# Altium schematic sheet uP.SchDoc
size A3
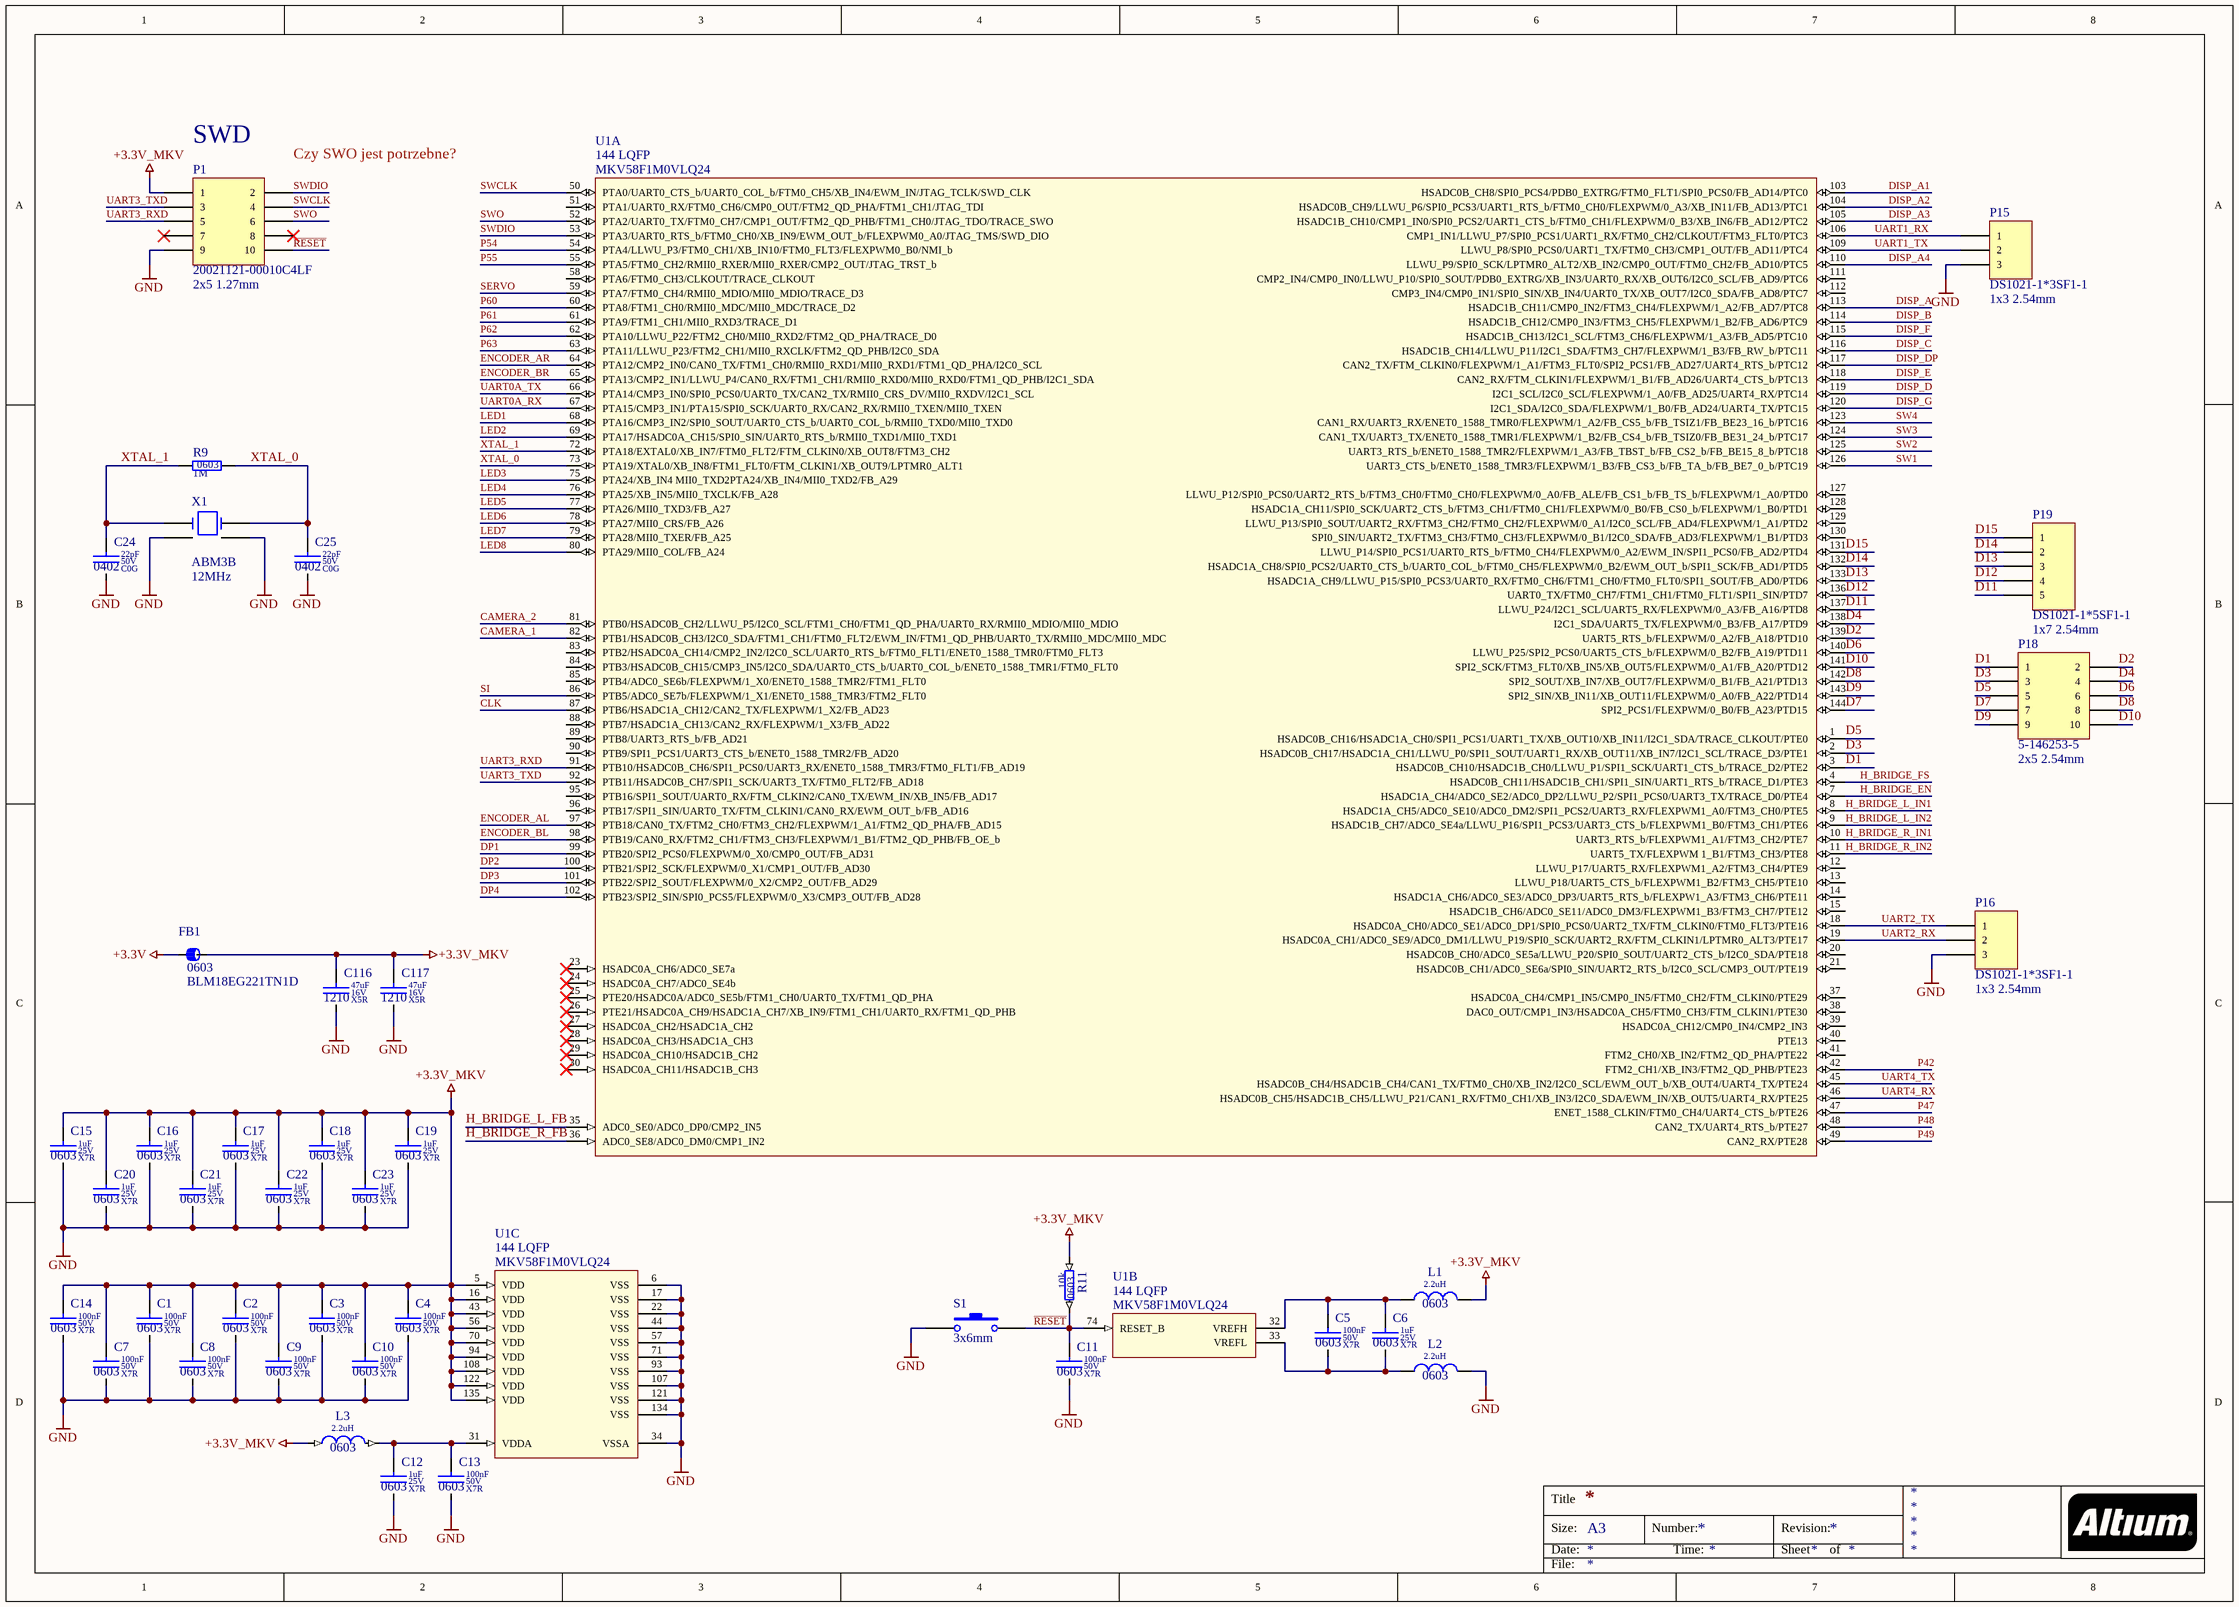
[diagram p0: uP.SchDoc]

## Parts
C1  value 100nF  Dielectric: X7R  Voltage: 50V  SCH_Footprint: 0603  [C_0603_1608]  (hidden comment: Ceramic X7R)
C2  value 100nF  Dielectric: X7R  Voltage: 50V  SCH_Footprint: 0603  [C_0603_1608]  (hidden comment: Ceramic X7R)
C3  value 100nF  Dielectric: X7R  Voltage: 50V  SCH_Footprint: 0603  [C_0603_1608]  (hidden comment: Ceramic X7R)
C4  value 100nF  Dielectric: X7R  Voltage: 50V  SCH_Footprint: 0603  [C_0603_1608]  (hidden comment: Ceramic X7R)
C5  value 100nF  Dielectric: X7R  Voltage: 50V  SCH_Footprint: 0603  [C_0603_1608]  (hidden comment: Ceramic X7R)
C6  value 1uF  Dielectric: X7R  Voltage: 25V  SCH_Footprint: 0603  [C_0603_1608]  (hidden comment: Ceramic X7R)
C7  value 100nF  Dielectric: X7R  Voltage: 50V  SCH_Footprint: 0603  [C_0603_1608]  (hidden comment: Ceramic X7R)
C8  value 100nF  Dielectric: X7R  Voltage: 50V  SCH_Footprint: 0603  [C_0603_1608]  (hidden comment: Ceramic X7R)
C9  value 100nF  Dielectric: X7R  Voltage: 50V  SCH_Footprint: 0603  [C_0603_1608]  (hidden comment: Ceramic X7R)
C10  value 100nF  Dielectric: X7R  Voltage: 50V  SCH_Footprint: 0603  [C_0603_1608]  (hidden comment: Ceramic X7R)
C11  value 100nF  Dielectric: X7R  Voltage: 50V  SCH_Footprint: 0603  [C_0603_1608]  (hidden comment: Ceramic X7R)
C12  value 1uF  Dielectric: X7R  Voltage: 25V  SCH_Footprint: 0603  [C_0603_1608]  (hidden comment: Ceramic X7R)
C13  value 100nF  Dielectric: X7R  Voltage: 50V  SCH_Footprint: 0603  [C_0603_1608]  (hidden comment: Ceramic X7R)
C14  value 100nF  Dielectric: X7R  Voltage: 50V  SCH_Footprint: 0603  [C_0603_1608]  (hidden comment: Ceramic X7R)
C15  value 1uF  Dielectric: X7R  Voltage: 25V  SCH_Footprint: 0603  [C_0603_1608]  (hidden comment: Ceramic X7R)
C16  value 1uF  Dielectric: X7R  Voltage: 25V  SCH_Footprint: 0603  [C_0603_1608]  (hidden comment: Ceramic X7R)
C17  value 1uF  Dielectric: X7R  Voltage: 25V  SCH_Footprint: 0603  [C_0603_1608]  (hidden comment: Ceramic X7R)
C18  value 1uF  Dielectric: X7R  Voltage: 25V  SCH_Footprint: 0603  [C_0603_1608]  (hidden comment: Ceramic X7R)
C19  value 1uF  Dielectric: X7R  Voltage: 25V  SCH_Footprint: 0603  [C_0603_1608]  (hidden comment: Ceramic X7R)
C20  value 1uF  Dielectric: X7R  Voltage: 25V  SCH_Footprint: 0603  [C_0603_1608]  (hidden comment: Ceramic X7R)
C21  value 1uF  Dielectric: X7R  Voltage: 25V  SCH_Footprint: 0603  [C_0603_1608]  (hidden comment: Ceramic X7R)
C22  value 1uF  Dielectric: X7R  Voltage: 25V  SCH_Footprint: 0603  [C_0603_1608]  (hidden comment: Ceramic X7R)
C23  value 1uF  Dielectric: X7R  Voltage: 25V  SCH_Footprint: 0603  [C_0603_1608]  (hidden comment: Ceramic X7R)
C24  value 22pF  Dielectric: C0G  Voltage: 50V  SCH_Footprint: 0402  [C_0402_1005]  (hidden comment: Ceramic C0G)
C25  value 22pF  Dielectric: C0G  Voltage: 50V  SCH_Footprint: 0402  [C_0402_1005]  (hidden comment: Ceramic C0G)
C116  value 47uF  Dielectric: X5R  Voltage: 16V  SCH_Footprint: 1210  [C_1210_3225]  (hidden comment: Ceramic X5R)
C117  value 47uF  Dielectric: X5R  Voltage: 16V  SCH_Footprint: 1210  [C_1210_3225]  (hidden comment: Ceramic X5R)
FB1  value BLM18EG221TN1D  SCH_Footprint: 0603  [FB_0603_1608]  (hidden comment: Ferrite bead)
L1  value 2.2uH  SCH_Footprint: 0603  [L_0603_1608]  (hidden comment: Inductor)
L2  value 2.2uH  SCH_Footprint: 0603  [L_0603_1608]  (hidden comment: Inductor)
L3  value 2.2uH  SCH_Footprint: 0603  [L_0603_1608]  (hidden comment: Inductor)
P1  value 20021121-00010C4LF  SCH_Footprint: 2x5 1.27mm  [P_HEADER_2x5_1.27]  (hidden comment: Jtag)
P15  value DS1021-1*3SF1-1  SCH_Footprint: 1x3 2.54mm  [P_HEADER_1x3_2.54]  (hidden comment: Goldpin)
P16  value DS1021-1*3SF1-1  SCH_Footprint: 1x3 2.54mm  [P_HEADER_1x3_2.54]  (hidden comment: Goldpin)
P18  value 5-146253-5  SCH_Footprint: 2x5 2.54mm  [P_HEADER_2x5_2.54]  (hidden comment: Goldpin)
P19  value DS1021-1*5SF1-1  SCH_Footprint: 1x7 2.54mm  [P_HEADER_1x5_2.54]  (hidden comment: Goldpin)
R9  value 1M  SCH_Footprint: 0603  [R_0603_1608]  (hidden comment: Resistor)
R11  value 10k  SCH_Footprint: 0603  [R_0603_1608]  (hidden comment: Resistor)
S1  3x6mm  [S_TACTSWITCH3x6]
U1  SCH_Footprint: 144 LQFP  [LQFP144_20x20]  (hidden comment: MKV58F1M0VLQ24)  (parts A,B,C of 3)
X1  value 12MHz  SCH_Footprint: ABM3B  [X_ABM3B_5X3X11]  (hidden comment: X_ABM3B)

## Nets
+3.3V: FB1.1
+3.3V_MKV: C1.1 C2.1 C3.1 C4.1 C7.1 C8.1 C9.1 C10.1 C14.1 C15.1 C16.1 C17.1 C18.1 C19.1 C20.1 C21.1 C22.1 C23.1 C116.1 C117.1 FB1.2 L1.2 L3.1 P1.1 R11.1 U1.5(VDD) U1.16(VDD) U1.43(VDD) U1.56(VDD) U1.70(VDD) U1.94(VDD) U1.108(VDD) U1.122(VDD) U1.135(VDD)
GND: C1.2 C2.2 C3.2 C4.2 C7.2 C8.2 C9.2 C10.2 C11.2 C12.2 C13.2 C14.2 C15.2 C16.2 C17.2 C18.2 C19.2 C20.2 C21.2 C22.2 C23.2 C24.2 C25.2 C116.2 C117.2 L2.2 P1.9 P15.3 P16.3 S1.1 U1.6(VSS) U1.17(VSS) U1.22(VSS) U1.34(VSSA) U1.44(VSS) U1.57(VSS) U1.71(VSS) U1.93(VSS) U1.107(VSS) U1.121(VSS) U1.134(VSS) X1.2(GND) X1.4(GND)
CAMERA_1: U1.82(PTB1/HSADC0B_CH3/I2C0_SDA/FTM1_CH1/FTM0_FLT2/EWM_IN/FTM1_QD_PHB/UART0_TX/RMII0_MDC/MII0_MDC)
CAMERA_2: U1.81(PTB0/HSADC0B_CH2/LLWU_P5/I2C0_SCL/FTM1_CH0/FTM1_QD_PHA/UART0_RX/RMII0_MDIO/MII0_MDIO)
CLK: U1.87(PTB6/HSADC1A_CH12/CAN2_TX/FLEXPWM/1_X2/FB_AD23)
D1: P18.1 U1.3(HSADC0B_CH10/HSADC1B_CH0/LLWU_P1/SPI1_SCK/UART1_CTS_b/TRACE_D2/PTE2)
D2: P18.2 U1.139(UART5_RTS_b/FLEXPWM/0_A2/FB_A18/PTD10)
D3: P18.3 U1.2(HSADC0B_CH17/HSADC1A_CH1/LLWU_P0/SPI1_SOUT/UART1_RX/XB_OUT11/XB_IN7/I2C1_SCL/TRACE_D3/PTE1)
D4: P18.4 U1.138(I2C1_SDA/UART5_TX/FLEXPWM/0_B3/FB_A17/PTD9)
D5: P18.5 U1.1(HSADC0B_CH16/HSADC1A_CH0/SPI1_PCS1/UART1_TX/XB_OUT10/XB_IN11/I2C1_SDA/TRACE_CLKOUT/PTE0)
D6: P18.6 U1.140(LLWU_P25/SPI2_PCS0/UART5_CTS_b/FLEXPWM/0_B2/FB_A19/PTD11)
D7: P18.7 U1.144(SPI2_PCS1/FLEXPWM/0_B0/FB_A23/PTD15)
D8: P18.8 U1.142(SPI2_SOUT/XB_IN7/XB_OUT7/FLEXPWM/0_B1/FB_A21/PTD13)
D9: P18.9 U1.143(SPI2_SIN/XB_IN11/XB_OUT11/FLEXPWM/0_A0/FB_A22/PTD14)
D10: P18.10 U1.141(SPI2_SCK/FTM3_FLT0/XB_IN5/XB_OUT5/FLEXPWM/0_A1/FB_A20/PTD12)
D11: P19.5 U1.137(LLWU_P24/I2C1_SCL/UART5_RX/FLEXPWM/0_A3/FB_A16/PTD8)
D12: P19.4 U1.136(UART0_TX/FTM0_CH7/FTM1_CH1/FTM0_FLT1/SPI1_SIN/PTD7)
D13: P19.3 U1.133(HSADC1A_CH9/LLWU_P15/SPI0_PCS3/UART0_RX/FTM0_CH6/FTM1_CH0/FTM0_FLT0/SPI1_SOUT/FB_AD0/PTD6)
D14: P19.2 U1.132(HSADC1A_CH8/SPI0_PCS2/UART0_CTS_b/UART0_COL_b/FTM0_CH5/FLEXPWM/0_B2/EWM_OUT_b/SPI1_SCK/FB_AD1/PTD5)
D15: P19.1 U1.131(LLWU_P14/SPI0_PCS1/UART0_RTS_b/FTM0_CH4/FLEXPWM/0_A2/EWM_IN/SPI1_PCS0/FB_AD2/PTD4)
DISP_A: U1.113(HSADC1B_CH11/CMP0_IN2/FTM3_CH4/FLEXPWM/1_A2/FB_AD7/PTC8)
DISP_A1: U1.103(HSADC0B_CH8/SPI0_PCS4/PDB0_EXTRG/FTM0_FLT1/SPI0_PCS0/FB_AD14/PTC0)
DISP_A2: U1.104(HSADC0B_CH9/LLWU_P6/SPI0_PCS3/UART1_RTS_b/FTM0_CH0/FLEXPWM/0_A3/XB_IN11/FB_AD13/PTC1)
DISP_A3: U1.105(HSADC1B_CH10/CMP1_IN0/SPI0_PCS2/UART1_CTS_b/FTM0_CH1/FLEXPWM/0_B3/XB_IN6/FB_AD12/PTC2)
DISP_A4: U1.110(LLWU_P9/SPI0_SCK/LPTMR0_ALT2/XB_IN2/CMP0_OUT/FTM0_CH2/FB_AD10/PTC5)
DISP_B: U1.114(HSADC1B_CH12/CMP0_IN3/FTM3_CH5/FLEXPWM/1_B2/FB_AD6/PTC9)
DISP_C: U1.116(HSADC1B_CH14/LLWU_P11/I2C1_SDA/FTM3_CH7/FLEXPWM/1_B3/FB_RW_b/PTC11)
DISP_D: U1.119(I2C1_SCL/I2C0_SCL/FLEXPWM/1_A0/FB_AD25/UART4_RX/PTC14)
DISP_DP: U1.117(CAN2_TX/FTM_CLKIN0/FLEXPWM/1_A1/FTM3_FLT0/SPI2_PCS1/FB_AD27/UART4_RTS_b/PTC12)
DISP_E: U1.118(CAN2_RX/FTM_CLKIN1/FLEXPWM/1_B1/FB_AD26/UART4_CTS_b/PTC13)
DISP_F: U1.115(HSADC1B_CH13/I2C1_SCL/FTM3_CH6/FLEXPWM/1_A3/FB_AD5/PTC10)
DISP_G: U1.120(I2C1_SDA/I2C0_SDA/FLEXPWM/1_B0/FB_AD24/UART4_TX/PTC15)
DP1: U1.99(PTB20/SPI2_PCS0/FLEXPWM/0_X0/CMP0_OUT/FB_AD31)
DP2: U1.100(PTB21/SPI2_SCK/FLEXPWM/0_X1/CMP1_OUT/FB_AD30)
DP3: U1.101(PTB22/SPI2_SOUT/FLEXPWM/0_X2/CMP2_OUT/FB_AD29)
DP4: U1.102(PTB23/SPI2_SIN/SPI0_PCS5/FLEXPWM/0_X3/CMP3_OUT/FB_AD28)
ENCODER_AL: U1.97(PTB18/CAN0_TX/FTM2_CH0/FTM3_CH2/FLEXPWM/1_A1/FTM2_QD_PHA/FB_AD15)
ENCODER_AR: U1.64(PTA12/CMP2_IN0/CAN0_TX/FTM1_CH0/RMII0_RXD1/MII0_RXD1/FTM1_QD_PHA/I2C0_SCL)
ENCODER_BL: U1.98(PTB19/CAN0_RX/FTM2_CH1/FTM3_CH3/FLEXPWM/1_B1/FTM2_QD_PHB/FB_OE_b)
ENCODER_BR: U1.65(PTA13/CMP2_IN1/LLWU_P4/CAN0_RX/FTM1_CH1/RMII0_RXD0/MII0_RXD0/FTM1_QD_PHB/I2C1_SDA)
H_BRIDGE_EN: U1.7(HSADC1A_CH4/ADC0_SE2/ADC0_DP2/LLWU_P2/SPI1_PCS0/UART3_TX/TRACE_D0/PTE4)
H_BRIDGE_FS: U1.4(HSADC0B_CH11/HSADC1B_CH1/SPI1_SIN/UART1_RTS_b/TRACE_D1/PTE3)
H_BRIDGE_L_FB: U1.35(ADC0_SE0/ADC0_DP0/CMP2_IN5)
H_BRIDGE_L_IN1: U1.8(HSADC1A_CH5/ADC0_SE10/ADC0_DM2/SPI1_PCS2/UART3_RX/FLEXPWM1_A0/FTM3_CH0/PTE5)
H_BRIDGE_L_IN2: U1.9(HSADC1B_CH7/ADC0_SE4a/LLWU_P16/SPI1_PCS3/UART3_CTS_b/FLEXPWM1_B0/FTM3_CH1/PTE6)
H_BRIDGE_R_FB: U1.36(ADC0_SE8/ADC0_DM0/CMP1_IN2)
H_BRIDGE_R_IN1: U1.10(UART3_RTS_b/FLEXPWM1_A1/FTM3_CH2/PTE7)
H_BRIDGE_R_IN2: U1.11(UART5_TX/FLEXPWM_1_B1/FTM3_CH3/PTE8)
LED1: U1.68(PTA16/CMP3_IN2/SPI0_SOUT/UART0_CTS_b/UART0_COL_b/RMII0_TXD0/MII0_TXD0)
LED2: U1.69(PTA17/HSADC0A_CH15/SPI0_SIN/UART0_RTS_b/RMII0_TXD1/MII0_TXD1)
LED3: U1.75(PTA24/XB_IN4_MII0_TXD2PTA24/XB_IN4/MII0_TXD2/FB_A29)
LED4: U1.76(PTA25/XB_IN5/MII0_TXCLK/FB_A28)
LED5: U1.77(PTA26/MII0_TXD3/FB_A27)
LED6: U1.78(PTA27/MII0_CRS/FB_A26)
LED7: U1.79(PTA28/MII0_TXER/FB_A25)
LED8: U1.80(PTA29/MII0_COL/FB_A24)
P42: U1.42(FTM2_CH1/XB_IN3/FTM2_QD_PHB/PTE23)
P47: U1.47(ENET_1588_CLKIN/FTM0_CH4/UART4_CTS_b/PTE26)
P48: U1.48(CAN2_TX/UART4_RTS_b/PTE27)
P49: U1.49(CAN2_RX/PTE28)
P54: U1.54(PTA4/LLWU_P3/FTM0_CH1/XB_IN10/FTM0_FLT3/FLEXPWM0_B0/NMI_b)
P55: U1.55(PTA5/FTM0_CH2/RMII0_RXER/MII0_RXER/CMP2_OUT/JTAG_TRST_b)
P60: U1.60(PTA8/FTM1_CH0/RMII0_MDC/MII0_MDC/TRACE_D2)
P61: U1.61(PTA9/FTM1_CH1/MII0_RXD3/TRACE_D1)
P62: U1.62(PTA10/LLWU_P22/FTM2_CH0/MII0_RXD2/FTM2_QD_PHA/TRACE_D0)
P63: U1.63(PTA11/LLWU_P23/FTM2_CH1/MII0_RXCLK/FTM2_QD_PHB/I2C0_SDA)
~{RESET}: C11.1 P1.10 R11.2 S1.2 U1.74(RESET_B)
SERVO: U1.59(PTA7/FTM0_CH4/RMII0_MDIO/MII0_MDIO/TRACE_D3)
SI: U1.86(PTB5/ADC0_SE7b/FLEXPWM/1_X1/ENET0_1588_TMR3/FTM2_FLT0)
SW1: U1.126(UART3_CTS_b/ENET0_1588_TMR3/FLEXPWM/1_B3/FB_CS3_b/FB_TA_b/FB_BE7_0_b/PTC19)
SW2: U1.125(UART3_RTS_b/ENET0_1588_TMR2/FLEXPWM/1_A3/FB_TBST_b/FB_CS2_b/FB_BE15_8_b/PTC18)
SW3: U1.124(CAN1_TX/UART3_TX/ENET0_1588_TMR1/FLEXPWM/1_B2/FB_CS4_b/FB_TSIZ0/FB_BE31_24_b/PTC17)
SW4: U1.123(CAN1_RX/UART3_RX/ENET0_1588_TMR0/FLEXPWM/1_A2/FB_CS5_b/FB_TSIZ1/FB_BE23_16_b/PTC16)
SWCLK: P1.4 U1.50(PTA0/UART0_CTS_b/UART0_COL_b/FTM0_CH5/XB_IN4/EWM_IN/JTAG_TCLK/SWD_CLK)
SWDIO: P1.2 U1.53(PTA3/UART0_RTS_b/FTM0_CH0/XB_IN9/EWM_OUT_b/FLEXPWM0_A0/JTAG_TMS/SWD_DIO)
SWO: P1.6 U1.52(PTA2/UART0_TX/FTM0_CH7/CMP1_OUT/FTM2_QD_PHB/FTM1_CH0/JTAG_TDO/TRACE_SWO)
UART0A_RX: U1.67(PTA15/CMP3_IN1/PTA15/SPI0_SCK/UART0_RX/CAN2_RX/RMII0_TXEN/MII0_TXEN)
UART0A_TX: U1.66(PTA14/CMP3_IN0/SPI0_PCS0/UART0_TX/CAN2_TX/RMII0_CRS_DV/MII0_RXDV/I2C1_SCL)
UART1_RX: P15.1 U1.106(CMP1_IN1/LLWU_P7/SPI0_PCS1/UART1_RX/FTM0_CH2/CLKOUT/FTM3_FLT0/PTC3)
UART1_TX: P15.2 U1.109(LLWU_P8/SPI0_PCS0/UART1_TX/FTM0_CH3/CMP1_OUT/FB_AD11/PTC4)
UART2_RX: P16.2 U1.19(HSADC0A_CH1/ADC0_SE9/ADC0_DM1/LLWU_P19/SPI0_SCK/UART2_RX/FTM_CLKIN1/LPTMR0_ALT3/PTE17)
UART2_TX: P16.1 U1.18(HSADC0A_CH0/ADC0_SE1/ADC0_DP1/SPI0_PCS0/UART2_TX/FTM_CLKIN0/FTM0_FLT3/PTE16)
UART3_RXD: P1.5 U1.91(PTB10/HSADC0B_CH6/SPI1_PCS0/UART3_RX/ENET0_1588_TMR3/FTM0_FLT1/FB_AD19)
UART3_TXD: P1.3 U1.92(PTB11/HSADC0B_CH7/SPI1_SCK/UART3_TX/FTM0_FLT2/FB_AD18)
UART4_RX: U1.46(HSADC0B_CH5/HSADC1B_CH5/LLWU_P21/CAN1_RX/FTM0_CH1/XB_IN3/I2C0_SDA/EWM_IN/XB_OUT5/UART4_RX/PTE25)
UART4_TX: U1.45(HSADC0B_CH4/HSADC1B_CH4/CAN1_TX/FTM0_CH0/XB_IN2/I2C0_SCL/EWM_OUT_b/XB_OUT4/UART4_TX/PTE24)
XTAL_0: C25.1 R9.2 U1.73(PTA19/XTAL0/XB_IN8/FTM1_FLT0/FTM_CLKIN1/XB_OUT9/LPTMR0_ALT1) X1.1
XTAL_1: C24.1 R9.1 U1.72(PTA18/EXTAL0/XB_IN7/FTM0_FLT2/FTM_CLKIN0/XB_OUT8/FTM3_CH2) X1.3
NetC5_1: C5.1 C6.1 L1.1 U1.32(VREFH)
NetC5_2: C5.2 C6.2 L2.1 U1.33(VREFL)
NetC12_1: C12.1 C13.1 L3.2 U1.31(VDDA)

Not connected (* = marked no-connect by the designer): P1 7* 8*; U1 12(LLWU_P17/UART5_RX/FLEXPWM1_A2/FTM3_CH4/PTE9) 13(LLWU_P18/UART5_CTS_b/FLEXPWM1_B2/FTM3_CH5/PTE10) 14(HSADC1A_CH6/ADC0_SE3/ADC0_DP3/UART5_RTS_b/FLEXPW1_A3/FTM3_CH6/PTE11) 15(HSADC1B_CH6/ADC0_SE11/ADC0_DM3/FLEXPWM1_B3/FTM3_CH7/PTE12) 20(HSADC0B_CH0/ADC0_SE5a/LLWU_P20/SPI0_SOUT/UART2_CTS_b/I2C0_SDA/PTE18) 21(HSADC0B_CH1/ADC0_SE6a/SPI0_SIN/UART2_RTS_b/I2C0_SCL/CMP3_OUT/PTE19) 23(HSADC0A_CH6/ADC0_SE7a)* 24(HSADC0A_CH7/ADC0_SE4b)* 25(PTE20/HSADC0A/ADC0_SE5b/FTM1_CH0/UART0_TX/FTM1_QD_PHA)* 26(PTE21/HSADC0A_CH9/HSADC1A_CH7/XB_IN9/FTM1_CH1/UART0_RX/FTM1_QD_PHB)* 27(HSADC0A_CH2/HSADC1A_CH2)* 28(HSADC0A_CH3/HSADC1A_CH3)* 29(HSADC0A_CH10/HSADC1B_CH2)* 30(HSADC0A_CH11/HSADC1B_CH3)* 37(HSADC0A_CH4/CMP1_IN5/CMP0_IN5/FTM0_CH2/FTM_CLKIN0/PTE29) 38(DAC0_OUT/CMP1_IN3/HSADC0A_CH5/FTM0_CH3/FTM_CLKIN1/PTE30) 39(HSADC0A_CH12/CMP0_IN4/CMP2_IN3) 40(PTE13) 41(FTM2_CH0/XB_IN2/FTM2_QD_PHA/PTE22) 51(PTA1/UART0_RX/FTM0_CH6/CMP0_OUT/FTM2_QD_PHA/FTM1_CH1/JTAG_TDI) 58(PTA6/FTM0_CH3/CLKOUT/TRACE_CLKOUT) 83(PTB2/HSADC0A_CH14/CMP2_IN2/I2C0_SCL/UART0_RTS_b/FTM0_FLT1/ENET0_1588_TMR0/FTM0_FLT3) 84(PTB3/HSADC0B_CH15/CMP3_IN5/I2C0_SDA/UART0_CTS_b/UART0_COL_b/ENET0_1588_TMR1/FTM0_FLT0) 85(PTB4/ADC0_SE6b/FLEXPWM/1_X0/ENET0_1588_TMR2/FTM1_FLT0) 88(PTB7/HSADC1A_CH13/CAN2_RX/FLEXPWM/1_X3/FB_AD22) 89(PTB8/UART3_RTS_b/FB_AD21) 90(PTB9/SPI1_PCS1/UART3_CTS_b/ENET0_1588_TMR2/FB_AD20) 95(PTB16/SPI1_SOUT/UART0_RX/FTM_CLKIN2/CAN0_TX/EWM_IN/XB_IN5/FB_AD17) 96(PTB17/SPI1_SIN/UART0_TX/FTM_CLKIN1/CAN0_RX/EWM_OUT_b/FB_AD16) 111(CMP2_IN4/CMP0_IN0/LLWU_P10/SPI0_SOUT/PDB0_EXTRG/XB_IN3/UART0_RX/XB_OUT6/I2C0_SCL/FB_AD9/PTC6) 112(CMP3_IN4/CMP0_IN1/SPI0_SIN/XB_IN4/UART0_TX/XB_OUT7/I2C0_SDA/FB_AD8/PTC7) 127(LLWU_P12/SPI0_PCS0/UART2_RTS_b/FTM3_CH0/FTM0_CH0/FLEXPWM/0_A0/FB_ALE/FB_CS1_b/FB_TS_b/FLEXPWM/1_A0/PTD0) 128(HSADC1A_CH11/SPI0_SCK/UART2_CTS_b/FTM3_CH1/FTM0_CH1/FLEXPWM/0_B0/FB_CS0_b/FLEXPWM/1_B0/PTD1) 129(LLWU_P13/SPI0_SOUT/UART2_RX/FTM3_CH2/FTM0_CH2/FLEXPWM/0_A1/I2C0_SCL/FB_AD4/FLEXPWM/1_A1/PTD2) 130(SPI0_SIN/UART2_TX/FTM3_CH3/FTM0_CH3/FLEXPWM/0_B1/I2C0_SDA/FB_AD3/FLEXPWM/1_B1/PTD3)

## Notes on the sheet
- (near P1) SWD
- (near P1) Czy SWO jest potrzebne?
- Title
- Size:
- Date:
- A3
- Number:
- Time:
- Revision:
- Sheet
- of
- File:

## Library data of the parts
C1-C5 C7-C11 C13 C14 = C_100nF_50V_X7R_0603_5: Capacitor; Manufacturer: Samsung; Manufacturer Part Number: CL10B104JB8NNNC; Tolerance (%): 5; Part Number: C_100nF_50V_X7R_0603_5; HelpURL: http://www.tme.eu/pl/Document/4a42202b32dab16128fe107dd69598cc/samsung-chip-cap.pdf; Supplier 1: TME; Supplier Part Number 1: CL10B104JB8NNNC; Supplier 2: RS Components; Supplier 3: Farnell; Supplier 4: Mouser; Supplier 5: Digi-Key
C6 C12 C15-C23 = C_1uF_25V_X7R_0603_10: Capacitor; Manufacturer: Samsung; Manufacturer Part Number: CL10B105KA8NNNC; Tolerance (%): 10; Part Number: C_1uF_25V_X7R_0603_10; HelpURL: http://www.tme.eu/pl/Document/4a42202b32dab16128fe107dd69598cc/samsung-chip-cap.pdf; Supplier 1: TME; Supplier Part Number 1: CL10B105KA8NNNC; Supplier 2: RS Components; Supplier 3: Farnell; Supplier 4: Mouser; Supplier 5: Digi-Key
C24 C25 = C_22pF_50V_C0G_0402_5: Capacitor; Manufacturer: AVX; Manufacturer Part Number: 04025A220JAT2A; Tolerance (%): 5; Part Number: C_22pF_50V_C0G_0402_5; HelpURL: http://datasheet.octopart.com/04025A220JAT2A-AVX-datasheet-9883399.pdf; Supplier 1: TME; Supplier Part Number 1: 04025A220JAT2A; Supplier 2: RS Components; Supplier Part Number 2: 6983087; Supplier 3: Farnell; Supplier Part Number 3: 2280776; Supplier 4: Mouser; Supplier Part Number 4: 581-04025A220J; Supplier 5: Digi-Key; Supplier Part Number 5: 478-1074-1-ND
C116 C117 = C_47uF_16V_X5R_1210_10: Capacitor; Manufacturer: Samsung; Manufacturer Part Number: CL32A476KOJNNNE; Tolerance (%): 10; Part Number: C_47uF_16V_X5R_1210_10; HelpURL: http://www.samsungsem.com/kr/support/product-search/mlcc/__icsFiles/afieldfile/2018/06/21/CL32A476KOJNNNE.pdf; Supplier 1: TME; Supplier 2: RS Components; Supplier 3: Farnell; Supplier 4: Mouser; Supplier 5: Digi-Key; Supplier Part Number 5: 1276-3376-1-ND
FB1 = FB_BLM18EG221TN1D: Manufacturer: Murata; Current: 1A; Resistance: 150mR; Part Number: FB_BLM18EG221TN1D; HelpURL: http://datasheet.octopart.com/BLM18EG221TN1D-Murata-datasheet-66919.pdf; Manufacturer Part Number: BLM18EG221TN1D; Supplier 1: TME; Supplier 2: RS Components; Supplier Part Number 2: 7926243P; Supplier 3: Farnell; Supplier Part Number 3: 1515717; Supplier 4: Mouser; Supplier Part Number 4: 81-BLM18EG221TN1D; Supplier 5: Digi-Key; Supplier Part Number 5: 490-5979-1-ND
L1-L3 = L_2.2uH_130mA_0603: Induction; Manufacturer: TDK; Manufacturer Part Number: MLZ1608A2R2WT000; Current: 130mA; Resistance: 250mR; Part Number: L_2.2uH_130mA_0603; HelpURL: http://datasheet.octopart.com/MLZ1608A2R2WT000-TDK-datasheet-38159369.pdf; Supplier 1: TME; Supplier 2: RS Components; Supplier 3: Farnell; Supplier Part Number 3: 2215629; Supplier 4: Mouser; Supplier Part Number 4: 810-MLZ1608A2R2WT000; Supplier 5: Digi-Key; Supplier Part Number 5: 445-6385-1-ND
P1 = P_HEADER_2x5_1.27: Header, 10-Pin, Dual row; Manufacturer: FCI; Part Number: P_HEADER_2x5_1.27; Component Type: Standard; HelpURL: http://www.mouser.com/catalog/645/usd/1591.pdf; Manufacturer Part Number: 20021121-00010C4LF; Supplier 1: TME; Supplier 2: RS Components; Supplier 3: Farnell; Supplier 4: Mouser; Supplier 5: Digi-Key
P15 P16 = P_HEADER_1x3_2.54: Header, 3-Pin; Manufacturer: Connfly; Part Number: P_HEADER_1x3_2.54; Component Type: Standard; HelpURL: http://www.tme.eu/en/Document/cc301e58a5da78cb543a94b5a5b7f06a/DS1021.pdf; Manufacturer Part Number: DS1021-1*3SF1-1; Supplier 1: TME; Supplier Part Number 1: ZL201-03G; Supplier 2: RS Components; Supplier 3: Farnell; Supplier 4: Mouser; Supplier 5: Digi-Key
P18 = P_HEADER_2x5_2.54: Header, 10-Pin, Dual row; Manufacturer: TE Connectivity; Part Number: P_HEADER_2x5_2.54; Component Type: Standard; HelpURL: https://sigma.octopart.com/11631052/technical_drawing/TE-Connectivity-5-146253-5.pdf; Manufacturer Part Number: 5-146253-5; Supplier 1: TME; Supplier 2: RS Components; Supplier Part Number 2: 782-9205; Supplier 3: Farnell; Supplier Part Number 3: 2311131; Supplier 4: Mouser; Supplier Part Number 4: 571-5-146253-5; Supplier 5: Digi-Key; Supplier Part Number 5: A121461-ND
P19 = P_HEADER_1x5_2.54: Header, 5-Pin; Manufacturer: Connfly; Part Number: P_HEADER_1x5_2.54; Component Type: Standard; HelpURL: http://datasheet.octopart.com/DS1021-1%2A5SF1-1-Connfly-datasheet-65537859.pdf; Manufacturer Part Number: DS1021-1*5SF1-1; Supplier 1: TME; Supplier Part Number 1: ZL201-05G; Supplier 2: RS Components; Supplier 3: Farnell; Supplier 4: Mouser; Supplier 5: Digi-Key
R9 = R_1M_0603_1: Manufacturer: Bourns; Manufacturer Part Number: CR0603-FX-1004ELF; Voltage: 50V; Power: 100mW; Tolerance: 1%; Part Number: R_1M_0603_1; HelpURL: https://datasheet.octopart.com/CR0603-FX-1004ELF-Bourns-datasheet-5318152.pdf; Supplier 1: TME; Supplier 2: RS Components; Supplier 3: Farnell; Supplier Part Number 3: 2321755; Supplier 4: Mouser; Supplier Part Number 4: 652-CR0603FX-1004ELF; Supplier 5: Digi-Key; Supplier Part Number 5: CR0603-FX-1004ELFCT-ND
R11 = R_10k_0603_1: Manufacturer: Vishay; Manufacturer Part Number: CRCW060310K0FKTABC; Voltage: 75V; Power: 100mW; Tolerance: 1%; Part Number: R_10k_0603_1; HelpURL: http://www.tme.eu/pl/Document/622e28308c06d160637f2b14751ba16b/Data%20Sheet%20CRCW_BCe3.pdf; Supplier 1: TME; Supplier Part Number 1: CRCW060310K0FKTABC; Supplier 2: RS Components; Supplier 3: Farnell; Supplier 4: Mouser; Supplier Part Number 4: 667-ERJ-3EKF1002V; Supplier 5: Digi-Key; Supplier Part Number 5: P10KGCT-ND
S1 = S_TACTSWITCH: Tact Switch; Manufacturer: Ninigi; Manufacturer Part Number: TACTM-34N-F; Part Number: S_TACTSWITCH; SCH_Footprint: 3x6mm; HelpURL: http://pl.ninigi.com/product/tactm-34n-f/pdf; Supplier 1: TME; Supplier Part Number 1: TACTM-34N-F; Supplier 2: RS Components; Supplier 3: Farnell; Supplier 4: Mouser; Supplier 5: Digi-Key
U1 = U_MKV58F1M0VLQ24: 240 MHz Cortex-M7 based MCU for Real-time; Manufacturer: NXP; Value: MKV58F1M0VLQ24; Part Number: U_MKV58F1M0VLQ24; HelpURL: https://www.nxp.com/docs/en/data-sheet/KV5XP144M240.pdf; Manufacturer Part Number: MKV58F1M0VLQ24; Supplier 1: TME; Supplier 2: RS Components; Supplier 3: Farnell; Supplier Part Number 3: 2890236; Supplier 4: Mouser; Supplier Part Number 4: 841-MKV58F1M0VLQ24; Supplier 5: Digi-Key; Supplier Part Number 5: MKV58F1M0VLQ24-ND
X1 = X_12M8HZ_ABM3B: Part Number: X_12M8HZ_ABM3B; Supplier 1: TME; Supplier 2: RS Components; Supplier 3: Farnell; Supplier 4: Mouser; Supplier Part Number 4: 815-ABM3B-12.8-T; Supplier 5: Digi-Key; Supplier Part Number 5: 300-8199-1-ND